# Altium schematic sheet Sheet3.SchDoc
size A3
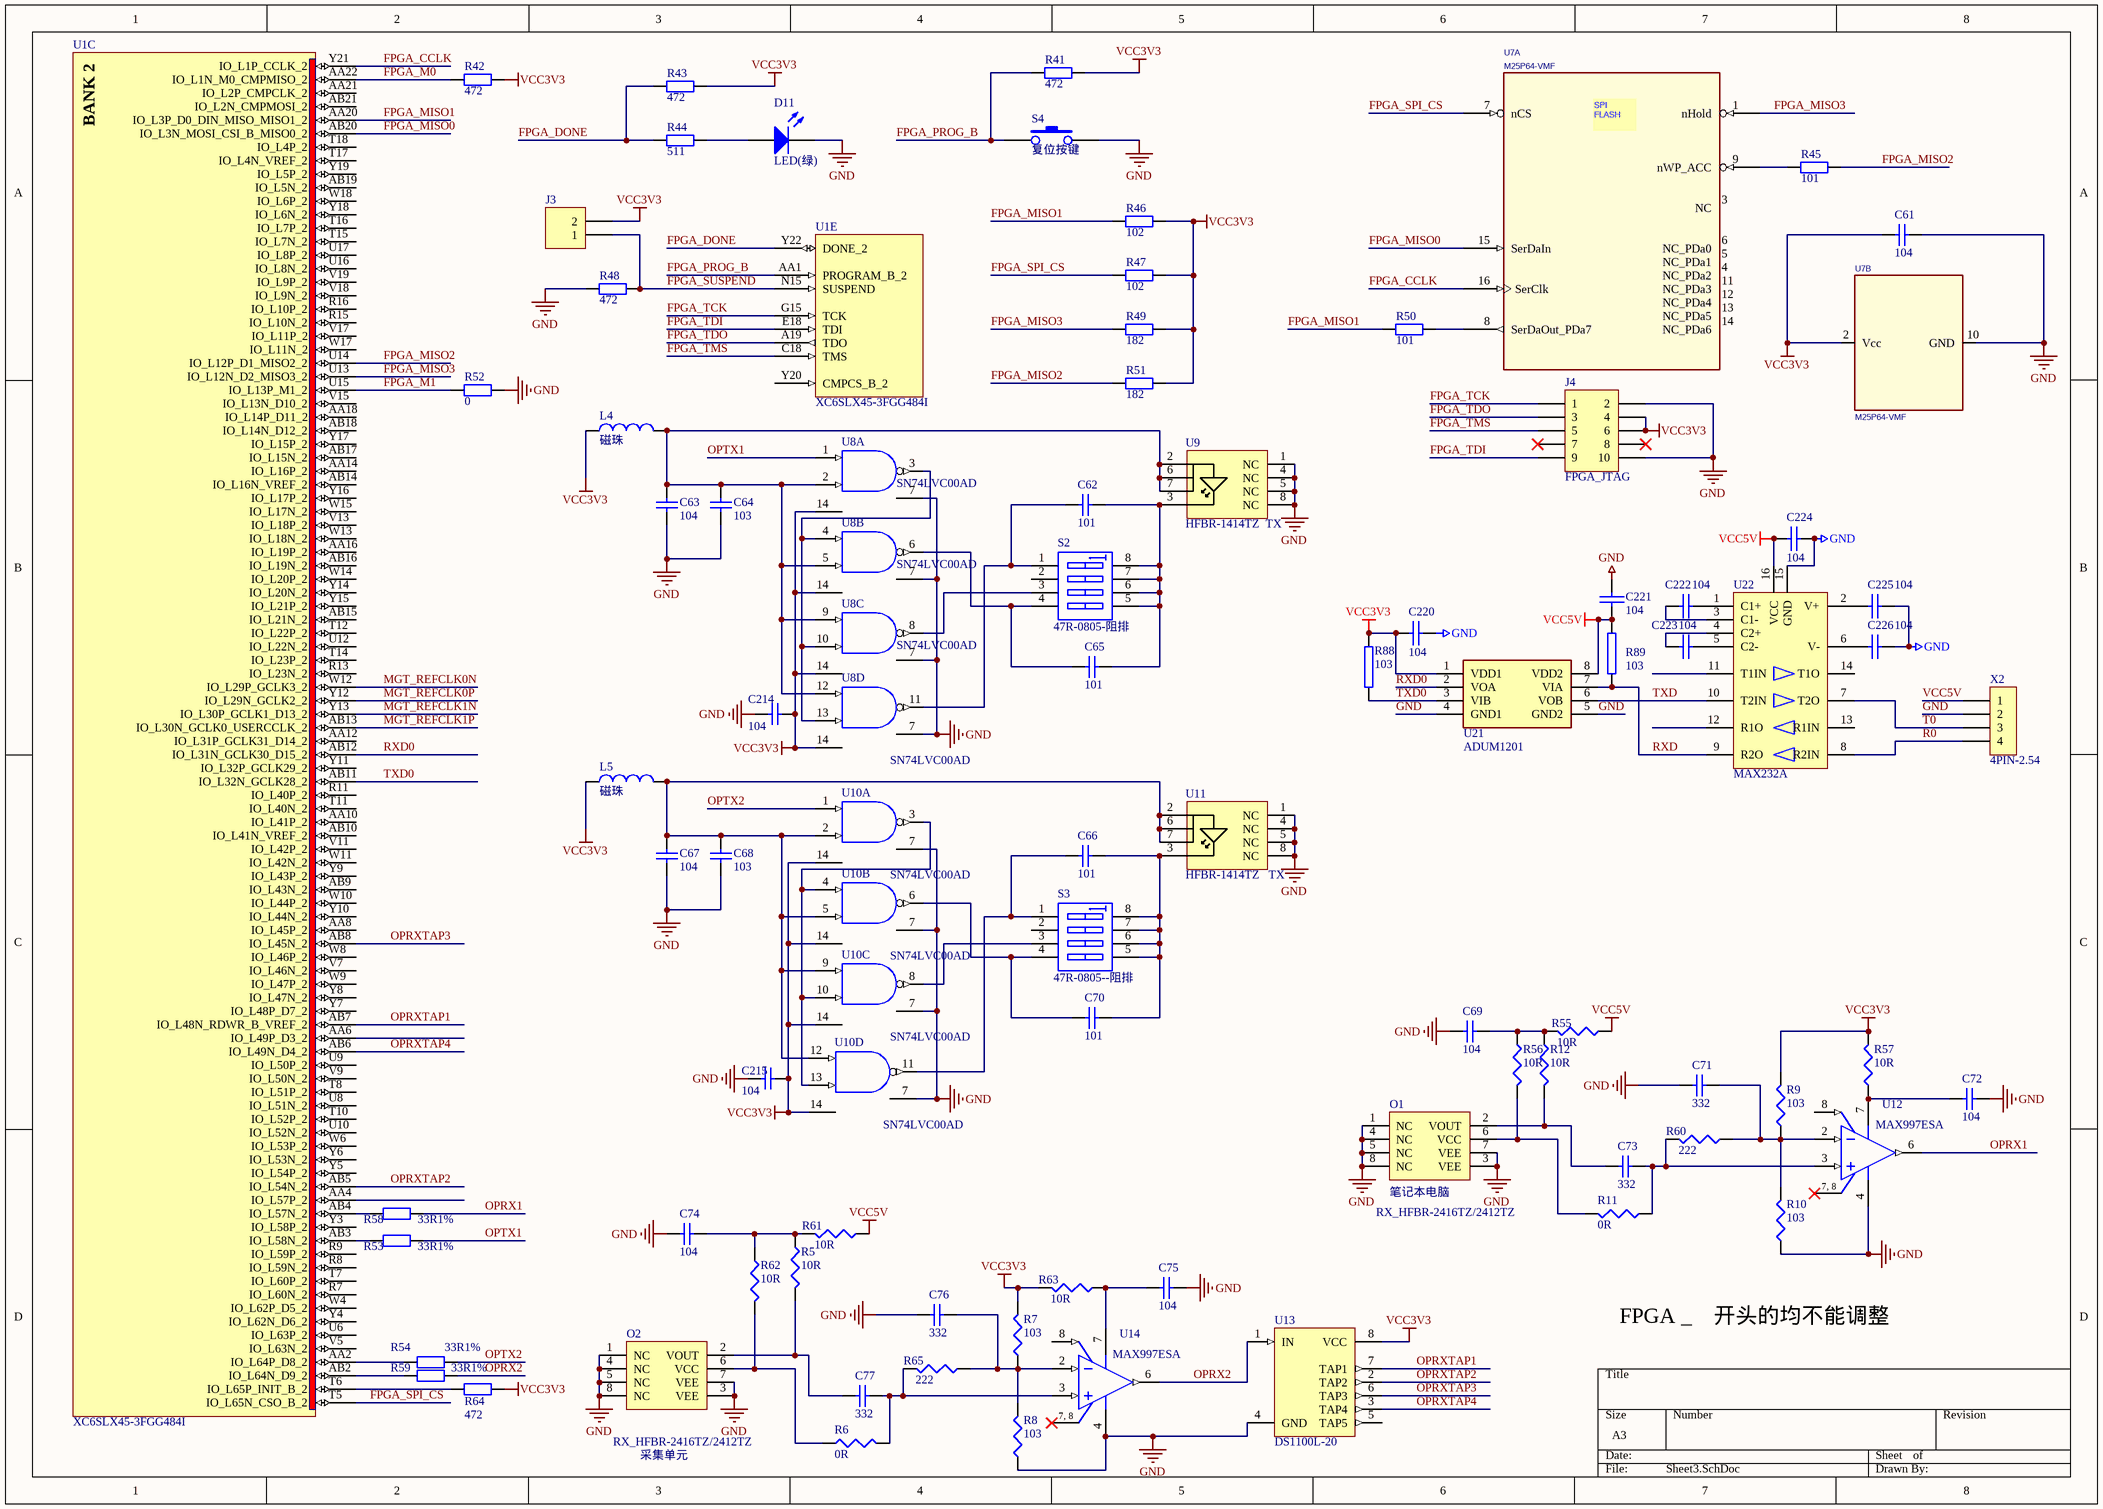
[diagram p0: Sheet3.SchDoc]

## Parts
C61  104  [0402]
C62  101  [0603]
C63  104  [0603]
C64  103  [0603]
C65  101  [0603]
C66  101  [0603]
C67  104  [0603]
C68  103  [0603]
C69  104  [0603]
C70  101  [0603]
C71  332  [0603]
C72  104  [0603]
C73  332  [0603]
C74  104  [0603]
C75  104  [0603]
C76  332  [0603]
C77  332  [0603]
C214  104  [0603]
C215  104  [0603]
C220  104  [0603X]
C221  104  [0603X]
C222  104  [0603X]
C223  104  [0603X]
C224  104  [0603X]
C225  104  [0603X]
C226  104  [0603X]
D11  LED(绿)  [0805LED]
J3  (no value)  [HDR1X2]
J4  FPGA_JTAG  [HDR2X5]
L4  磁珠  [1206A]
L5  磁珠  [1206A]
O1  RX_HFBR-2416TZ/2412TZ  [OPT]
O2  RX_HFBR-2416TZ/2412TZ  [OPT]
R5  10R  [0603]
R6  0R  [0603]
R7  103  [0603]
R8  103  [0603]
R9  103  [0603]
R10  103  [0603]
R11  0R  [0603]
R12  10R  [0603]
R41  472  [0603]
R42  472  [0603]
R43  472  [0603]
R44  511  [0603]
R45  101  [0603]
R46  102  [0603]
R47  102  [0603]
R48  472  [0603]
R49  182  [0603]
R50  101  [0603]
R51  182  [0603]
R52  0  [0603]
R53  33R1%  [0603]
R54  33R1%  [0603]
R55  10R  [0603]
R56  10R  [0603]
R57  10R  [0603]
R58  33R1%  [0603]
R59  33R1%  [0603]
R60  222  [0603]
R61  10R  [0603]
R62  10R  [0603]
R63  10R  [0603]
R64  472  [0603]
R65  222  [0603]
R88  103  [0603X]
R89  103  [0603X]
S2  47R-0805-阻排  [RNS001]
S3  47R-0805--阻排  [RNS001]
S4  复位按键  [RESETKEY]
U1  XC6SLX45-3FGG484I  [FGG484]  (parts C,E of 8)
U7  M25P64-VMF  [SOIC16]  (parts A,B of 2)
U8  SN74LVC00AD  [SMD14X]  (parts A,B,C,D of 4)
U9  HFBR-1414TZ  TX  [OPT]
U10  SN74LVC00AD  [SMD14X]  (parts A,B,C,D of 4)
U11  HFBR-1414TZ   TX  [OPT]
U12  MAX997ESA  [SMD8XX]
U13  DS1100L-20  [SMD8XX]
U14  MAX997ESA  [SMD8XX]
U21  ADUM1201  [SMD8XX]
U22  MAX232A  [SMD16XX]
X2  4PIN-2.54  [SIP4X]

## Nets
GND: C61.1 C63.2 C64.1 C67.2 C68.1 C69.2 C71.2 C72.2 C74.2 C75.2 C76.2 C214.2 C215.2 C220.2 C221.2 C224.1 C225.1 C226.1 D11.2(K) J4.2 J4.10 O1.1(NC) O1.3(VEE) O1.4(NC) O1.5(NC) O1.7(VEE) O1.8(NC) O2.1(NC) O2.3(VEE) O2.4(NC) O2.5(NC) O2.7(VEE) O2.8(NC) R8.1 R10.1 R48.1 R52.2 S4.2 U7.10(GND) U8.7(GND) U9.1(NC) U9.4(NC) U9.5(NC) U9.8(NC) U10.7(GND) U11.1(NC) U11.4(NC) U11.5(NC) U11.8(NC) U12.4(GND) U13.4(GND) U14.4(GND) U21.4(GND1) U21.5(GND2) U22.15(GND) X2.2
VCC: C61.2 C214.1 C215.1 C220.1 J3.2 J4.4 J4.6 L4.1 L5.1 R7.2 R9.2 R41.2 R42.2 R43.2 R46.2 R47.2 R49.2 R51.2 R57.2 R63.2 R64.2 R88.2 U7.2(Vcc) U8.14(VCC) U10.14(VCC) U13.8(VCC) U21.1(VDD1)  [also labelled VCC3V3]
VCC5V: C221.1 C224.2 R55.1 R61.1 R89.2 U21.8(VDD2) U22.16(VCC) X2.1
FPGA_CCLK: U1.Y21(IO_L1P_CCLK_2) U7.16(SerClk)
FPGA_DONE: R43.1 R44.1 U1.Y22(DONE_2)
FPGA_M0: R42.1 U1.AA22(IO_L1N_M0_CMPMISO_2)
FPGA_M1: R52.1 U1.U15(IO_L13P_M1_2)
FPGA_MISO0: U1.AB20(IO_L3N_MOSI_CSI_B_MISO0_2) U7.15(SerDaIn)
FPGA_MISO1: R46.1 R50.1 U1.AA20(IO_L3P_D0_DIN_MISO_MISO1_2)
FPGA_MISO2: R45.2 R51.1 U1.U14(IO_L12P_D1_MISO2_2)
FPGA_MISO3: R49.1 U1.U13(IO_L12N_D2_MISO3_2) U7.1(nHold)
FPGA_PROG_B: R41.1 S4.1 U1.AA1(PROGRAM_B_2)
FPGA_SPI_CS: R47.1 U1.T5(IO_L65N_CSO_B_2) U7.7(nCS)
FPGA_SUSPEND: J3.1 R48.2 U1.N15(SUSPEND)
FPGA_TCK: J4.1 U1.G15(TCK)
FPGA_TDI: J4.9 U1.E18(TDI)
FPGA_TDO: J4.3 U1.A19(TDO)
FPGA_TMS: J4.5 U1.C18(TMS)
MGT_REFCLK0N: U1.W12(IO_L29P_GCLK3_2)
MGT_REFCLK0P: U1.Y12(IO_L29N_GCLK2_2)
MGT_REFCLK1N: U1.Y13(IO_L30P_GCLK1_D13_2)
MGT_REFCLK1P: U1.AB13(IO_L30N_GCLK0_USERCCLK_2)
OPRX1: R58.1 U12.6(OUT)
OPRX2: R59.1 U13.1(IN) U14.6(OUT)
OPRXTAP1: U1.AB7(IO_L48N_RDWR_B_VREF_2) U13.7(TAP1)
OPRXTAP2: U1.AB5(IO_L54N_2) U13.2(TAP2)
OPRXTAP3: U1.AB8(IO_L45N_2) U13.6(TAP3)
OPRXTAP4: U1.AB6(IO_L49N_D4_2) U13.3(TAP4)
OPTX1: R53.1 U8.1(A)
OPTX2: R54.1 U10.1(A)
R0: U22.8(R2IN) X2.4
RXD: R89.1 U21.7(VIA) U22.9(R2O)
RXD0: U1.AB12(IO_L31N_GCLK30_D15_2) U21.2(VOA)
T0: U22.7(T2O) X2.3
TXD: U21.6(VOB) U22.10(T2IN)
TXD0: R88.1 U1.AB11(IO_L32N_GCLK28_2) U21.3(VIB)
NetC62_1: C62.1 C65.1 S2.5(B4) S2.6(B3) S2.7(B2) S2.8(B1) U9.3
NetC62_2: C62.2 S2.1(A1) U8.11(Y)
NetC63_1: C63.1 C64.2 L4.2 U8.2(B) U8.5(B) U8.9(A) U8.12(A) U9.2 U9.6 U9.7
NetC65_2: C65.2 S2.4(A4) U8.6(Y)
NetC66_1: C66.1 C70.1 S3.5(B4) S3.6(B3) S3.7(B2) S3.8(B1) U11.3
NetC66_2: C66.2 S3.1(A1) U10.11(Y)
NetC67_1: C67.1 C68.2 L5.2 U10.2(B) U10.5(B) U10.9(A) U10.12(A) U11.2 U11.6 U11.7
NetC69_1: C69.1 R12.1 R55.2 R56.1
NetC70_2: C70.2 S3.4(A4) U10.6(Y)
NetC71_1: C71.1 R9.1 R10.2 R60.1 U12.2(IN-)
NetC72_1: C72.1 R57.1 U12.7(VCC)
NetC73_1: C73.1 R11.1 R60.2 U12.3(IN+)
NetC73_2: C73.2 O1.2(VOUT) R12.2
NetC74_1: C74.1 R5.1 R61.2 R62.1
NetC75_1: C75.1 R63.1 U14.7(VCC)
NetC76_1: C76.1 R7.1 R8.2 R65.1 U14.2(IN-)
NetC77_1: C77.1 R6.2 R65.2 U14.3(IN+)
NetC77_2: C77.2 O2.2(VOUT) R5.2
NetC222_1: C222.1 U22.1(C1+)
NetC222_2: C222.2 U22.3(C1-)
NetC223_1: C223.1 U22.5(C2-)
NetC223_2: C223.2 U22.4(C2+)
NetC225_2: C225.2 U22.2(V+)
NetC226_2: C226.2 U22.6(V-)
NetD11_1: D11.1(A) R44.2
NetO1_6: O1.6(VCC) R11.2 R56.2
NetO2_6: O2.6(VCC) R6.1 R62.2
NetR45_1: R45.1 U7.9(nWP_ACC)
NetR50_2: R50.2 U7.8(SerDaOut_PDa7)
NetR53_2: R53.2 U1.AB3(IO_L58N_2)
NetR54_2: R54.2 U1.AA2(IO_L64P_D8_2)
NetR58_2: R58.2 U1.AB4(IO_L57N_2)
NetR59_2: R59.2 U1.AB2(IO_L64N_D9_2)
NetR64_1: R64.1 U1.T6(IO_L65P_INIT_B_2)
NetS2_3: S2.3(A3) U8.8(Y)
NetS3_3: S3.3(A3) U10.8(Y)
NetU8_3: U8.3(Y) U8.4(A) U8.10(B) U8.13(B)
NetU10_3: U10.3(Y) U10.4(A) U10.10(B) U10.13(B)
NetU12_1: U12.1(NC) U12.5(NC)
NetU14_1: U14.1(NC) U14.5(NC)

Not connected (* = marked no-connect by the designer): J4 7* 8*; S2 2(A2); S3 2(A2); U1 AA4(IO_L57P_2) AA6(IO_L49P_D3_2) AA8(IO_L45P_2) AA10(IO_L41P_2) AA12(IO_L31P_GCLK31_D14_2) AA14(IO_L16P_2) AA16(IO_L19P_2) AA18(IO_L14P_D11_2) AA21(IO_L2P_CMPCLK_2) AB9(IO_L43N_2) AB10(IO_L41N_VREF_2) AB14(IO_L16N_VREF_2) AB15(IO_L21N_2) AB16(IO_L19N_2) AB17(IO_L15N_2) AB18(IO_L14N_D12_2) AB19(IO_L5N_2) AB21(IO_L2N_CMPMOSI_2) R7(IO_L60N_2) R8(IO_L59N_2) R9(IO_L59P_2) R11(IO_L40P_2) R13(IO_L23N_2) R15(IO_L10N_2) R16(IO_L10P_2) T7(IO_L60P_2) T8(IO_L51P_2) T10(IO_L52P_2) T11(IO_L40N_2) T12(IO_L22P_2) T14(IO_L23P_2) T15(IO_L7N_2) T16(IO_L7P_2) T17(IO_L4N_VREF_2) T18(IO_L4P_2) U6(IO_L63P_2) U8(IO_L51N_2) U9(IO_L50P_2) U10(IO_L52N_2) U12(IO_L22N_2) U16(IO_L8N_2) U17(IO_L8P_2) V5(IO_L63N_2) V7(IO_L46N_2) V9(IO_L50N_2) V11(IO_L42P_2) V13(IO_L18P_2) V15(IO_L13N_D10_2) V17(IO_L11P_2) V18(IO_L9N_2) V19(IO_L9P_2) W4(IO_L62P_D5_2) W6(IO_L53P_2) W8(IO_L46P_2) W9(IO_L47P_2) W10(IO_L44P_2) W11(IO_L42N_2) W13(IO_L18N_2) W14(IO_L20P_2) W15(IO_L17N_2) W17(IO_L11N_2) W18(IO_L6P_2) Y3(IO_L58P_2) Y4(IO_L62N_D6_2) Y5(IO_L54P_2) Y6(IO_L53N_2) Y7(IO_L48P_D7_2) Y8(IO_L47N_2) Y9(IO_L43P_2) Y10(IO_L44N_2) Y11(IO_L32P_GCLK29_2) Y14(IO_L20N_2) Y15(IO_L21P_2) Y16(IO_L17P_2) Y17(IO_L15P_2) Y18(IO_L6N_2) Y19(IO_L5P_2) Y20(CMPCS_B_2); U7 3(NC) 4(NC_PDa2) 5(NC_PDa1) 6(NC_PDa0) 11(NC_PDa3) 12(NC_PDa4) 13(NC_PDa5) 14(NC_PDa6); U12 8(~{SHDN}); U13 5(TAP5); U14 8(~{SHDN}); U22 11(T1IN) 12(R1O) 13(R1IN) 14(T1O)

## Notes on the sheet
- (near O1) 笔记本电脑
- FPGA _    开头的均不能调整
- 采集单元
- (in symbol MAX998ESA) 7, 8
- (in symbol SPI FLASH 128Mb S25FL128P, part A) SPI / FLASH
- (in symbol XC6SLX45-3FGG484I, part C) BANK 2

## Library data of the parts
C61 C72 C75 C214 C215 = Cap: Capacitor; Value: 0.1uF; Published: 8-Jun-2000; LatestRevisionDate: 17-Jul-2002; LatestRevisionNote: Re-released for DXP Platform.; PackageReference: RAD-0.3; Publisher: Altium Limited
C62 C65 C66 C70 = Cap Semi: Capacitor (Semiconductor SIM Model); Value: ?uF; Published: 8-Jun-2000; LatestRevisionDate: 29-May-2009; LatestRevisionNote: IPC-7351 Footprint Added.; PackageReference: C1206; Publisher: Altium Limited; PackageDescription: Chip Capacitor
C63 C64 C67 C68 = Cap Semi: Capacitor (Semiconductor SIM Model); Value: ?pF; Published: 8-Jun-2000; LatestRevisionDate: 29-May-2009; LatestRevisionNote: IPC-7351 Footprint Added.; PackageReference: C1206; Publisher: Altium Limited; PackageDescription: Chip Capacitor
C69 C71 C73 C74 C76 C77 = Cap: Capacitor; Value: ?pF; Published: 8-Jun-2000; LatestRevisionDate: 17-Jul-2002; LatestRevisionNote: Re-released for DXP Platform.; PackageReference: RAD-0.3; Publisher: Altium Limited
C220-C226 = CAP: Capacitor
D11 = LED0: Typical INFRARED GaAs LED; Published: 8-Jun-2000; LatestRevisionDate: 08-Jul-2005; LatestRevisionNote: Mech Layer 1 removed.; PackageReference: LED-0; Publisher: Altium Limited
J3 = Header 2: Header, 2-Pin; LatestRevisionDate: 17-Jul-2002; LatestRevisionNote: Re-released for DXP Platform.; Publisher: Altium Limited
J4 = Header 5X2: Header, 5-Pin, Dual row; LatestRevisionDate: 17-Jul-2002; LatestRevisionNote: Re-released for DXP Platform.; Publisher: Altium Limited
L4 L5 = Inductor: Code_IEC: 1005; Value: 1uH 磁珠; Published: 8-Jun-2000; LatestRevisionDate: 29-May-2009; LatestRevisionNote: IPC-7351 Footprint Added.; PackageReference: 0402-A; Publisher: Altium Limited; PackageDescription: Chip Inductor; Code_JEITA: 0402
O1 O2 = OPTO
R5 R12 R55-R57 R61-R63 = Res3: Resistor; Published: 8-Jun-2000; LatestRevisionDate: 29-May-2009; LatestRevisionNote: IPC-7351 Footprint Added.; PackageReference: J1-0603; Publisher: Altium Limited; PackageDescription: Chip Resistor; Value: 10R
R6-R11 = Res3: Resistor; Value: 10R; Published: 8-Jun-2000; LatestRevisionDate: 29-May-2009; LatestRevisionNote: IPC-7351 Footprint Added.; PackageReference: J1-0603; Publisher: Altium Limited; PackageDescription: Chip Resistor
R41-R43 R48 R52 R64 = Res2: Resistor; Value: 4K7; Published: 8-Jun-2000; LatestRevisionDate: 17-Jul-2002; LatestRevisionNote: Re-released for DXP Platform.; PackageReference: AXIAL-0.4; Publisher: Altium Limited
R44 = Res2: Resistor; Value: 510; Published: 8-Jun-2000; LatestRevisionDate: 17-Jul-2002; LatestRevisionNote: Re-released for DXP Platform.; PackageReference: AXIAL-0.4; Publisher: Altium Limited
R45 R50 = Res2: Resistor; Value: 100R; Published: 8-Jun-2000; LatestRevisionDate: 17-Jul-2002; LatestRevisionNote: Re-released for DXP Platform.; PackageReference: AXIAL-0.4; Publisher: Altium Limited
R46 = Res2: Resistor; Value: DNP; Published: 8-Jun-2000; LatestRevisionDate: 17-Jul-2002; LatestRevisionNote: Re-released for DXP Platform.; PackageReference: AXIAL-0.4; Publisher: Altium Limited
R47 = Res2: Resistor; Value: 1K; Published: 8-Jun-2000; LatestRevisionDate: 17-Jul-2002; LatestRevisionNote: Re-released for DXP Platform.; PackageReference: AXIAL-0.4; Publisher: Altium Limited
R49 R51 = Res2: Resistor; Value: 1.8K; Published: 8-Jun-2000; LatestRevisionDate: 17-Jul-2002; LatestRevisionNote: Re-released for DXP Platform.; PackageReference: AXIAL-0.4; Publisher: Altium Limited
R53 R54 R58 R59 = Res2: Resistor; Value: 33R; Published: 8-Jun-2000; LatestRevisionDate: 17-Jul-2002; LatestRevisionNote: Re-released for DXP Platform.; PackageReference: AXIAL-0.4; Publisher: Altium Limited
R60 R65 = Res3: Resistor; Value: 2.2K; Published: 8-Jun-2000; LatestRevisionDate: 29-May-2009; LatestRevisionNote: IPC-7351 Footprint Added.; PackageReference: J1-0603; Publisher: Altium Limited; PackageDescription: Chip Resistor
R88 R89 = RES2
S2 S3 = SW DIP-4: DIP Switch, 4 Position, SPST; Published: 24-Mar-1999; LatestRevisionDate: 29-May-2009; LatestRevisionNote: IPC-7351 Footprint Added.; PackageVersion: Dec-2002; PackageReference: SO8; Publisher: Altium Limited; PackageDescription: 8-Pin Small Outline Integrated Circuit 1.27 mm Pitch; Code_JEDEC: MS-012-AA; Code_IPC: SOIC127P600-8
S4 = SW-PB
U1 = XC6SLX45-3FGG484I: Spartan-6 LX 1.2V FPGA, 316 User I/Os, 484-Ball Fine-Pitch BGA (1.0mm Pitch), Speed Grade 3, Industrial Grade, Pb-Free; FirstPublished: 17-Nov-2009; DatasheetVersion: ver1.3, Nov-2009; PackageVersion: ver1.1, Dec-2008; PackageReference: FGG484; Publisher: Altium Limited; PackageDescription: 484-Ball Fine Pitch Ball Grid Array 1.00 mm Pitch (FGG484) - Pb-Free; Code_JEDEC: MS-034-AAJ-1; Code_IPC: BGA100P22X22-484; ComponentLink1Description: Spartan-6 Datasheet; ComponentLink1URL: http://www.xilinx.com/support/documentation/data_sheets/ds160.pdf; ComponentLink2Description: Pinout Specification; ComponentLink2URL: http://www.xilinx.com/support/documentation/user_guides/ug385.pdf; ComponentLink3Description: FGG484 Package Drawing; ComponentLink3URL: http://www.xilinx.com/support/documentation/package_specs/fg484.pdf; ComponentLink4Description: Spartan-6 Documents; ComponentLink4URL: http://www.xilinx.com/support/documentation/spartan-6.htm; ComponentLink5Description: Xilinx.com Home; ComponentLink5URL: http://www.xilinx.com
U7 = SPI FLASH 128Mb S25FL128P: SPI FLASH 128Mbit, 104MHz, 64kB sector; Full Part No: S25FL128P0XMFI00; Manufacturer: Spansion; Volts: 3.3V; ALS Lib: L0505; CLASS: IC; Type: SPI; Case: SOIC16
U8 U10 = SN74LVC00AD: Quadruple 2-Input Positive-NAND Gate; Published: 8-Jun-2000; LatestRevisionDate: 13-Apr-2006; LatestRevisionNote: IPC-7351 Footprint Added.; DatasheetVersion: Jun-1998; PackageVersion: Jan-1998; PackageReference: D014; Publisher: Altium Limited; PackageDescription: 14-Pin Small Outline Integrated Circuit 1.27 mm Pitch; Code_IPC: SOIC127P600-14; ComponentLink1Description: Manufacturer Link; ComponentLink1URL: http://www.ti.com/; ComponentLink2Description: Datasheet; ComponentLink2URL: http://www-s.ti.com/sc/ds/SN54LVC00A.pdf
U9 U11 = HFBR-1414
U12 U14 = MAX998ESA: Single, SOT23, Single-Supply, High-Speed, Low-Power Comparator; Published: 23-Sep-2002; LatestRevisionDate: 13-Apr-2006; LatestRevisionNote: IPC-7351 Footprint Added.; DatasheetVersion: Rev 1; 1/98; PackageReference: NSO8; Publisher: Altium Limited; PackageDescription: 8-Pin Small Outline Integrated Circuit 1.27 mm Pitch; Code_JEDEC: MS-012-AA; Code_IPC: SOIC127P600-8; ComponentLink1Description: Manufacturer Link; ComponentLink1URL: http://www.maxim-ic.com/; ComponentLink2Description: Datasheet; ComponentLink2URL: http://pdfserv.maxim-ic.com/en/ds/MAX976-MAX998.pdf
U13 = DS1004Z-2: 5-Tap High-Speed Silicon Delay Line; Published: 13-Oct-2000; LatestRevisionDate: 13-Apr-2006; LatestRevisionNote: IPC-7351 Footprint Added.; DatasheetVersion: 17-Feb-1998; PackageVersion: 1999; PackageReference: SOIC8N; Publisher: Altium Limited; PackageDescription: 8-Pin Small Outline Integrated Circuit 1.27 mm Pitch; Code_IPC: SOIC127P600-8; ComponentLink1Description: Manufacturer Link; ComponentLink1URL: http://www.maxim-ic.com/; ComponentLink2Description: Datasheet; ComponentLink2URL: http://www.maxim-ic.com/getds.cfm?qv_pk=2601&ln=en
X2 = CON4: Connector